# EasyEDA Pro project DreamFly.eprj, board PCB2
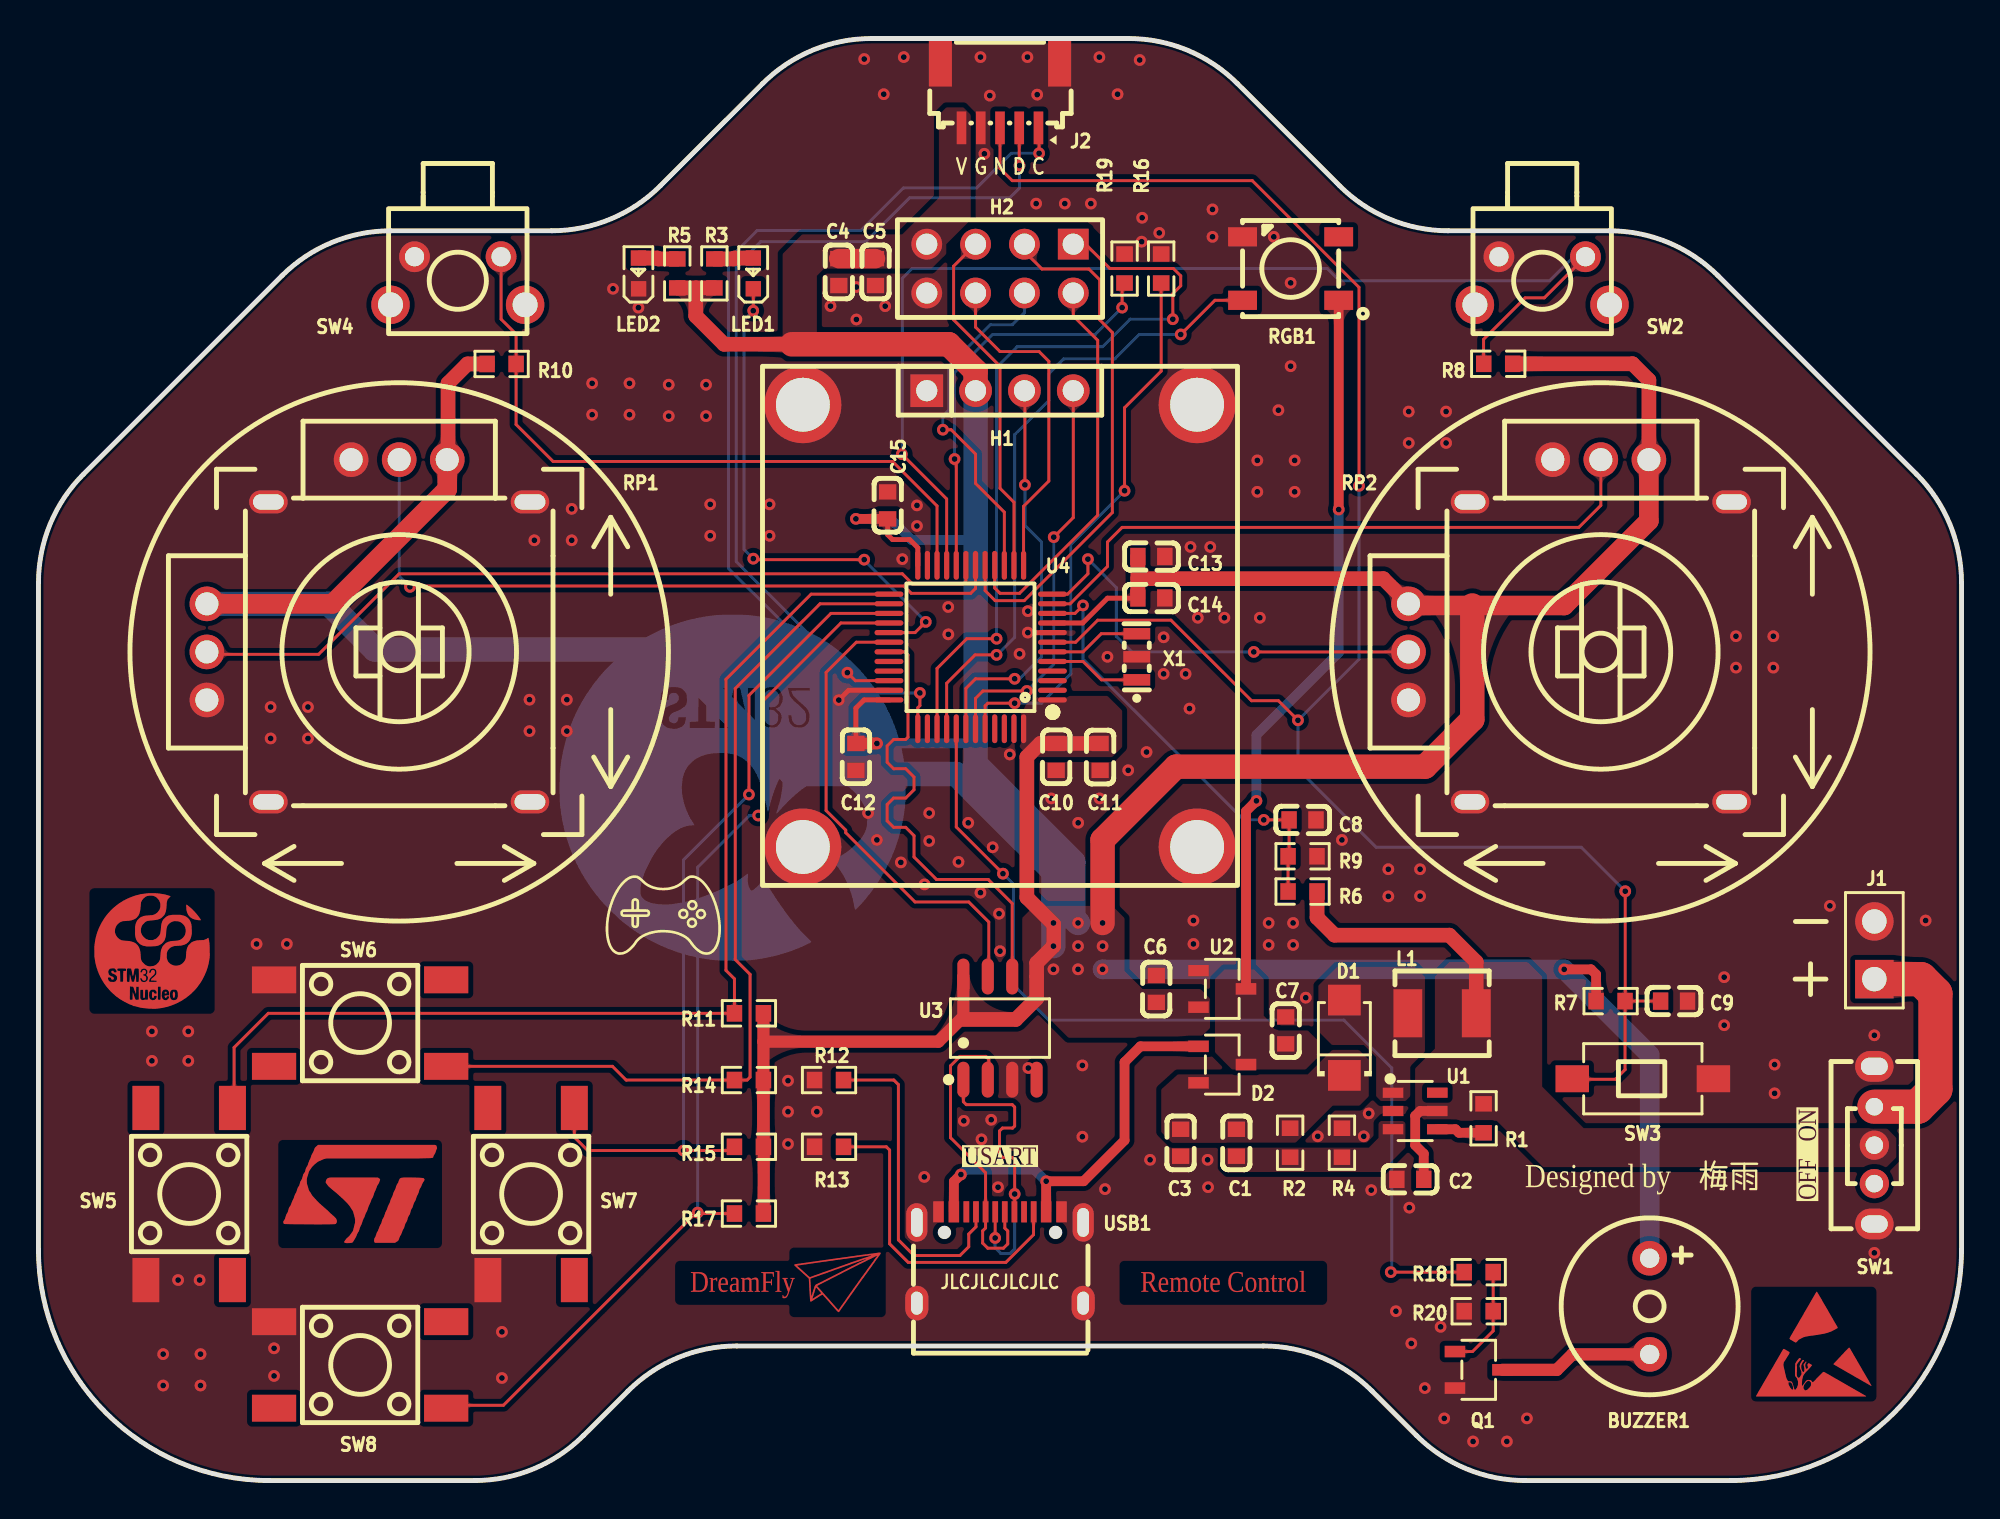
[diagram p6: board, top side]
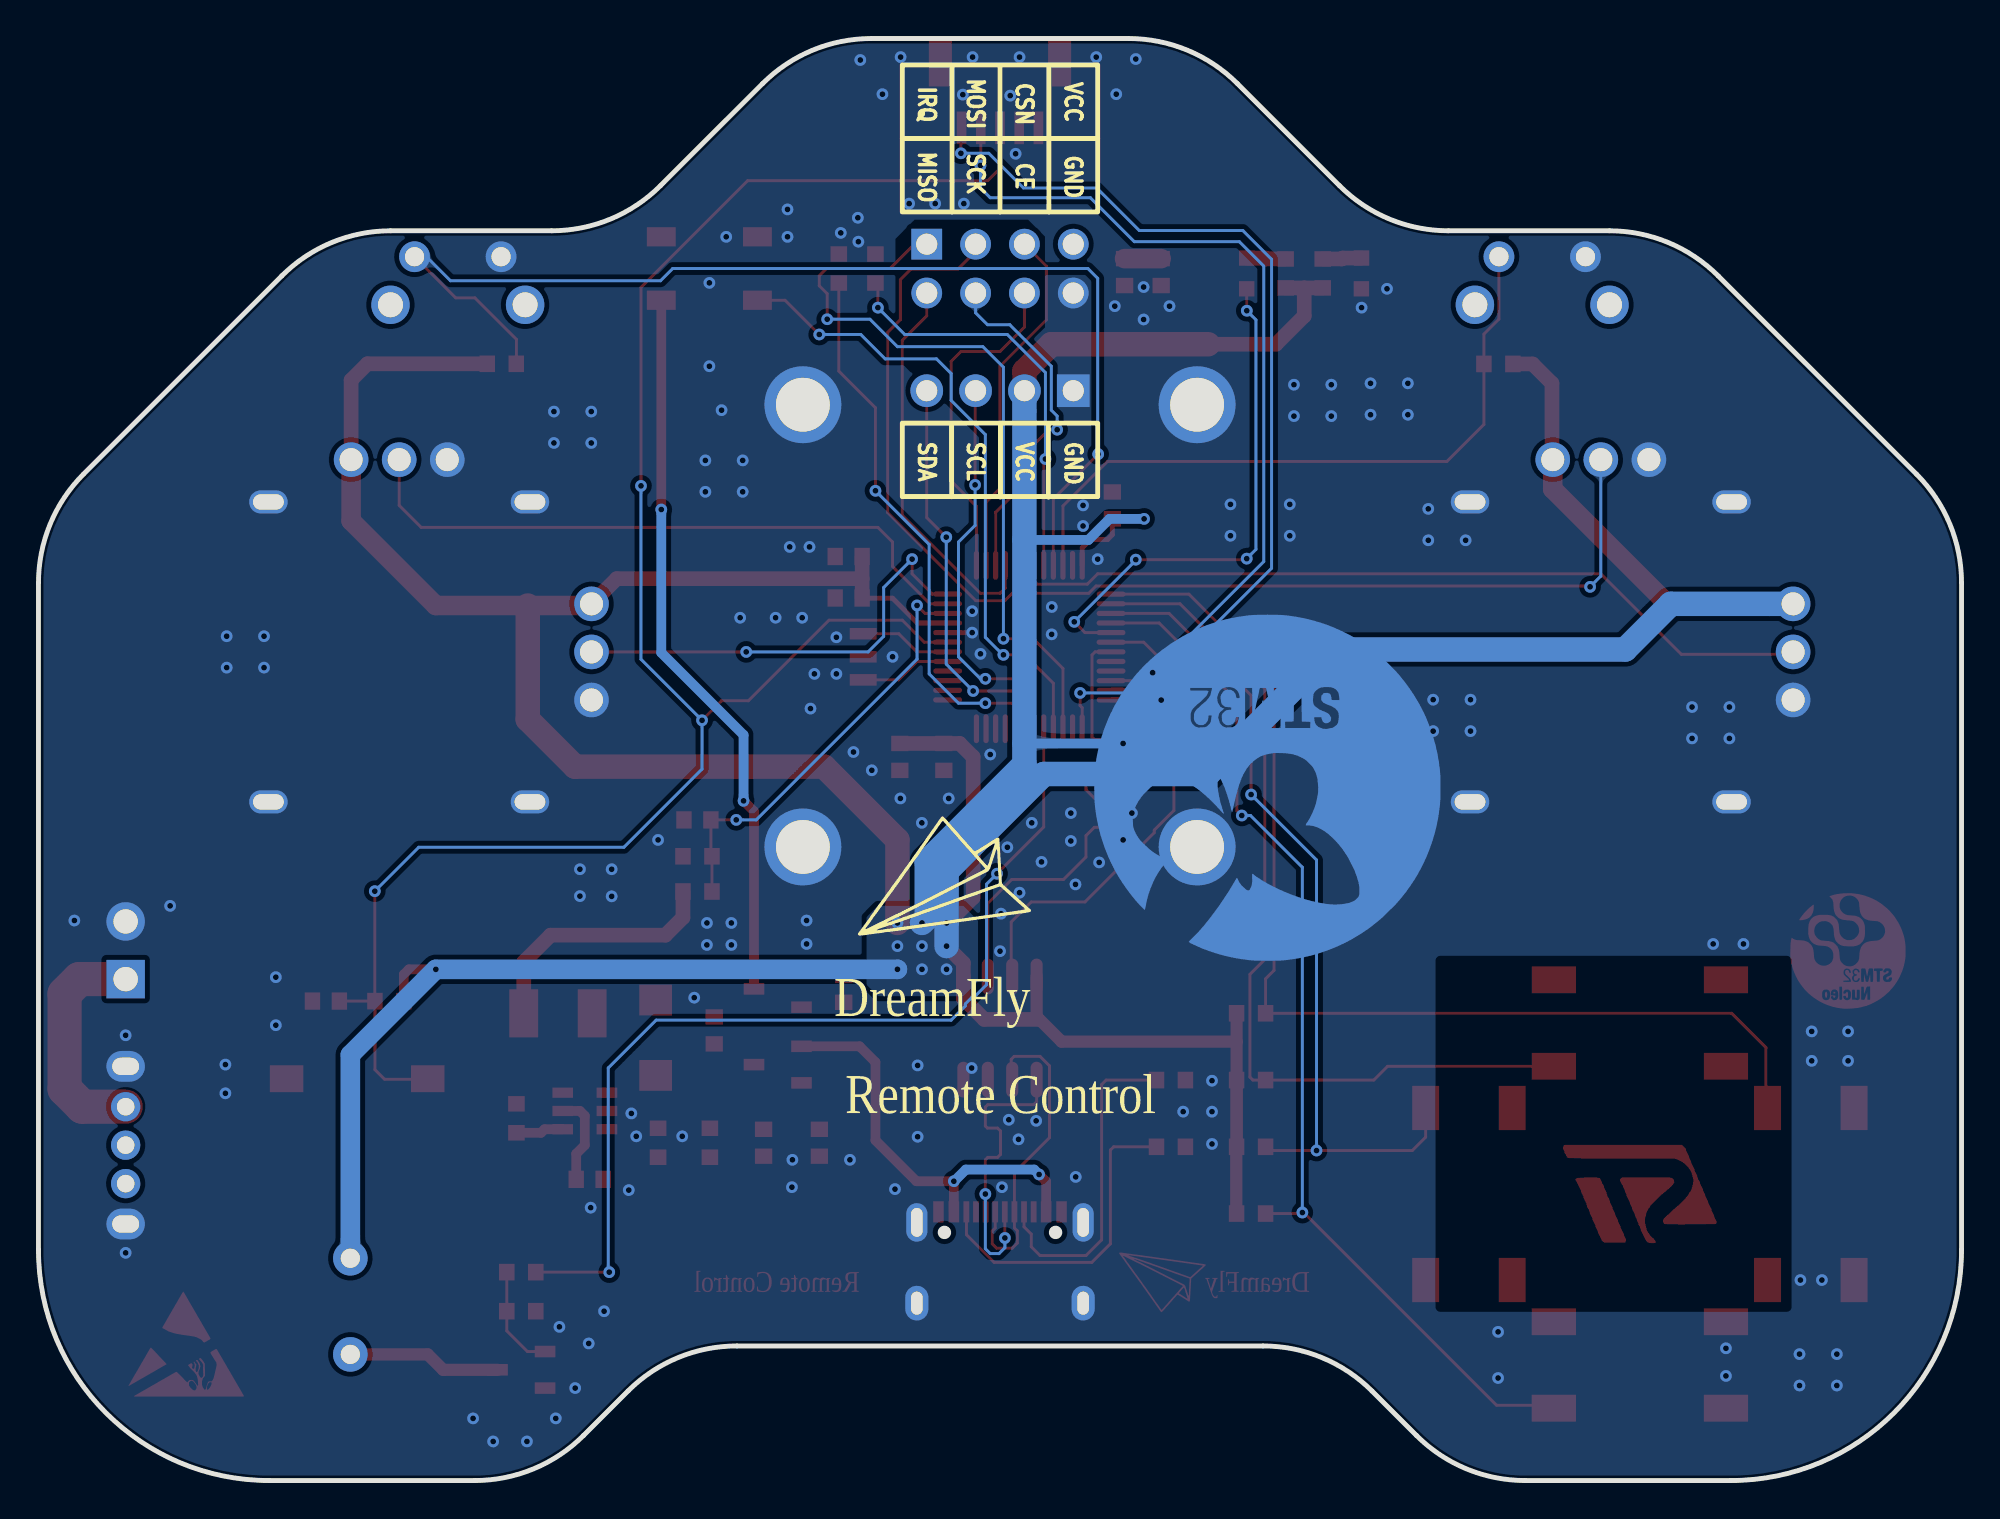
[diagram p7: board, bottom side, seen from below]

Outline 100 x 75 mm; copper layers: Top Layer, Bottom Layer. Coordinates in mm from the lower left corner of the outline.
Outline path: 0,46.69 0,12 arc(3.51,3.51) 12,0 22.69,0 arc(25.75,0.61) 28.34,2.34 30.66,4.66 arc(33.25,6.39) 36.31,7 63.69,7 arc(66.75,6.39) 69.34,4.66 71.66,2.34 arc(74.25,0.61) 77.31,0 88,0 arc(96.49,3.51) 100,12 100,46.69 arc(99.39,49.75) 97.66,52.34 87.34,62.66 arc(84.75,64.39) 81.69,65 73.31,65 arc(70.25,65.61) 67.66,67.34 62.34,72.66 arc(59.75,74.39) 56.69,75 43.31,75 arc(40.25,74.39) 37.66,72.66 32.34,67.34 arc(29.75,65.61) 26.69,65 18.31,65 arc(15.25,64.39) 12.66,62.66 2.34,52.34 arc(0.61,49.75) 0,46.69
Stack: Top Layer 0.035mm / Dielectric1 1.51mm FR4 er 4.5 / Bottom Layer 0.035mm

## Design rules (mm)
net USB_DM: DPDN
net USB_DP: DPDN
net U1_TX: USART
net U1_RX: USART
template: 自定义配置
spacing copperThickness1oz (default): track to track 0.102, other pairs 0 to 0.3
spacing copperThickness2oz: track to track 0.203, other pairs 0.152 to 0.3
track width copperThickness1oz (default): min 0.127, default 0.152, max 2.54
track width copperThickness2oz: min 0.203, default 0.254, max 2.54
differential pair differentialPair (default): width min 0.127, default 0.254, max 2.54; gap min 0.152, default 0.152
via viaSize (default): diameter min 0.5, default 0.61, max 10; hole min 0.3, default 0.305, max 6.299

## Placement (name value [footprint] x y rotation side)
BUZZER1  3kHz  [BUZ-TH_BD9.0-P5.00-D0.6-FD]  83.78 9.06 270 top
C1  15pF  [C0603]  62.29 17.57 90 top
C2  22uF  [C0603]  71.34 15.66 0 top
C3  22uF  [C0603]  59.39 17.57 90 top
C4  22uF  [C0603]  41.62 62.85 270 top
C5  100nF  [C0603]  43.52 62.85 270 top
C6  1uF  [C0603]  58.13 25.57 90 top
C7  1uF  [C0603]  64.86 23.41 90 top
C8  100nF  [C0603]  65.73 34.36 180 top
C9  100nF  [C0603]  85.05 24.94 0 top
C10  100nF  [C0603]  52.92 37.64 270 top
C11  100nF  [C0603]  55.21 37.64 90 top
C12  100nF  [C0603]  42.51 37.64 270 top
C13  1uF  [C0603]  57.87 48.06 180 top
C14  100nF  [C0603]  57.87 45.9 180 top
C15  100nF  [C0603]  44.16 50.72 270 top
D1  SS14F  [SMAF_L3.5-W2.6-LS4.7-RD]  67.91 23.03 90 top
D2  BAT54C  [SOT-23-3_L2.9-W1.6-P1.90-LS2.8-BR]  61.56 21.63 180 top
H1  Header 4  [HDR-TH_4P-P2.54-V-F]  50 56.68 0 top
H2  Header 8  [HDR-TH_8P-P2.54-V-F-R2-C4-S2.54]  50 63.03 180 top
J1  -  [BAT]  95.47 26.08 90 top
J2  SH1.0-5P  [CONN-SMD_5P-P1.00_BX-SH1.0-5PWT]  50 72.05 180 top
L1  4.7uH  [IND-SMD_L4.9-W4.4_MAPM0420F]  72.99 24.3 180 top
LED1  NCD0603B1  [LED0603-RD]  37.17 62.78 90 top
LED2  NCD0603R1  [LED0603-RD_RED]  31.2 62.78 90 top
NOREF  -  [Pad_e71]  39.75 55.95 0 top
NOREF#2  -  [Pad_e47]  39.75 32.95 0 top
NOREF#3  -  [Pad_e65]  60.25 32.95 0 top
NOREF#4  -  [Pad_e72]  60.25 55.95 0 top
Q1  S8050  [SOT-23-3_L2.9-W1.6-P1.90-LS2.8-BR]  74.89 5.76 180 top
R1  100kΩ  [R0603]  75.15 18.84 90 top
R2  73.2kΩ  [R0603]  65.09 17.57 90 top
R3  1kΩ  [R0603]  35.15 62.78 270 top
R4  10kΩ  [R0603]  67.78 17.57 270 top
R5  1kΩ  [R0603]  33.22 62.78 270 top
R6  100kΩ  [R0603]  65.73 30.64 180 top
R7  10kΩ  [R0603]  81.75 24.94 180 top
R8  10kΩ  [R0603]  75.91 58.08 0 top
R9  100kΩ  [R0603]  65.73 32.47 0 top
R10  10kΩ  [R0603]  24.08 58.07 180 top
R11  10kΩ  [R0603]  36.94 24.3 0 top
R12  5.1kΩ  [R0603]  41.11 20.83 180 top
R13  5.1kΩ  [R0603]  41.11 17.36 180 top
R14  10kΩ  [R0603]  36.94 20.83 0 top
R15  10kΩ  [R0603]  36.94 17.36 0 top
R16  10kΩ  [R0603]  58.38 63.04 270 top
R17  10kΩ  [R0603]  36.94 13.89 0 top
R18  1kΩ  [R0603]  74.89 10.84 180 top
R19  10kΩ  [R0603]  56.48 63.04 270 top
R20  10kΩ  [R0603]  74.89 8.81 0 top
RGB1  WS2812B  [LED-SMD_4P-L5.0-W5.0-BL_TC5050RGB]  65.11 63.04 180 top
RP1  LEFT  [RP-TH-LEFT]  18.76 43.1 0 top
RP2  RIGHT  [rp-th-right]  81.24 43.1 0 top
SW1  SS-12D07G4  [SW-TH_DEALON_SS-12D02-VGX]  95.47 17.44 270 top
SW2  TS-1093A-A5B3-D2  [KEY-TH_4P-L7.1-W8.9-P4.50-LS2.5]  78.19 62.4 180 top
SW3  TS-1101S-C-B-B-B-A  [SW-SMD_L6.0-W3.5-LS8.0]  83.43 20.9 180 top
SW4  TS-1093A-A5B3-D2  [KEY-TH_4P-L7.1-W8.9-P4.50-LS2.5]  21.81 62.4 180 top
SW5  TS-1002S-06026C  [KEY-SMD_4P-L6.0-W6.0-P4.50-LS9.5-BR]  7.84 14.9 90 top
SW6  TS-1002S-06026C  [KEY-SMD_4P-L6.0-W6.0-P4.50-LS9.5-BR]  16.73 23.79 0 top
SW7  TS-1002S-06026C  [KEY-SMD_4P-L6.0-W6.0-P4.50-LS9.5-BR]  25.62 14.9 90 top
SW8  TS-1002S-06026C  [KEY-SMD_4P-L6.0-W6.0-P4.50-LS9.5-BR]  16.73 6.01 0 top
U1  SX1308  [SOT-23-6_L2.9-W1.6-P0.95-LS2.8-BL]  71.59 19.22 270 top
U2  ME6206A33M3G  [SOT-23-3_L2.9-W1.6-P1.90-LS2.8-BR]  61.56 25.57 180 top
U3  CH340N  [SOP-8_L4.9-W3.9-P1.27-LS6.0-BL]  50 23.53 0 top
U4  STM32F103C8T6  [lqfp-48_l7.0-w7.0-p0.50-ls9.0-bl]  48.48 43.35 90 top
USB1  TYPE-C 16PIN  [USB-C-SMD_TYPE-C-6PIN-2MD-073]  50 11.6 0 top
X1  8MHz  [OSC-SMD_3P-L3.2-W1.3-P1.20-L]  57.11 42.84 90 top

## Footprints (pads in the part's own frame, mm; a bottom-side part is the same pattern mirrored in y, then rotated)
BAT
  rect 2x2 hole 1.27: 1(0,0)
  round 2 hole 1.27: 2(3,0)
BUZ-TH_BD9.0-P5.00-D0.6-FD
  round 1.8 hole 1: 1(-2.5,0) 2(2.5,0)
C0603
  rect 0.8x0.9 smd: 1(-0.7,0) 2(0.7,0)
CONN-SMD_5P-P1.00_BX-SH1.0-5PWT
  rect 0.5x1.7 smd: 1(-2,1.7) 2(-1,1.7) 3(0,1.7) 4(1,1.7) 5(2,1.7)
  rect 1.2x2.5 smd: 6(3.1,-1.7) 7(-3.1,-1.7)
HDR-TH_4P-P2.54-V-F
  rect 1.7x1.7 hole 1.1: 1(-3.81,0)
  round 1.7 hole 1.1: 2(-1.27,0) 3(1.27,0) 4(3.81,0)
HDR-TH_8P-P2.54-V-F-R2-C4-S2.54
  rect 1.6x1.6 hole 1.1: 1(-3.81,-1.27)
  round 1.6 hole 1.1: 2(-3.81,1.27) 3(-1.27,-1.27) 4(-1.27,1.27) 5(1.27,-1.27) 6(1.27,1.27) 7(3.81,-1.27) 8(3.81,1.27)
IND-SMD_L4.9-W4.4_MAPM0420F
  rect 1.5x2.5 smd: 1(-1.78,0) 2(1.78,0)
KEY-SMD_4P-L6.0-W6.0-P4.50-LS9.5-BR
  rect 2.3x1.4 smd: 1(4.475,-2.25) 2(-4.475,-2.25) 3(4.475,2.25) 4(-4.475,2.25)
KEY-TH_4P-L7.1-W8.9-P4.50-LS2.5
  round 1.6 hole 1: 1(-2.25,-1.25) 2(2.25,-1.25)
  round 2 hole 1.3: 3(-3.5,1.25) 4(3.5,1.25)
LED0603-RD
  rect 0.8x0.8 smd: 1(-0.799,0) 2(0.799,0)
LED0603-RD_RED
  rect 0.8x0.8 smd: 1(-0.799,-0.004) 2(0.799,0.004)
LED-SMD_4P-L5.0-W5.0-BL_TC5050RGB
  rect 1.5x1 smd: 1(-2.5,1.65) 2(-2.5,-1.65) 3(2.5,-1.65) 4(2.5,1.65)
lqfp-48_l7.0-w7.0-p0.50-ls9.0-bl
  oval 0.27x1.5 smd: 1(-2.75,-4.25) 2(-2.25,-4.25) 3(-1.75,-4.25) 4(-1.25,-4.25) 5(-0.75,-4.25) 6(-0.25,-4.25) 7(0.25,-4.25) 8(0.75,-4.25) 9(1.25,-4.25) 10(1.75,-4.25) 11(2.25,-4.25) 12(2.75,-4.25) 25(2.75,4.25) 26(2.25,4.25) 27(1.75,4.25) 28(1.25,4.25) 29(0.75,4.25) 30(0.25,4.25) 31(-0.25,4.25) 32(-0.75,4.25) 33(-1.25,4.25) 34(-1.75,4.25) 35(-2.25,4.25) 36(-2.75,4.25)
  oval 1.5x0.27 smd: 13(4.25,-2.75) 14(4.25,-2.25) 15(4.25,-1.75) 16(4.25,-1.25) 17(4.25,-0.75) 18(4.25,-0.25) 19(4.25,0.25) 20(4.25,0.75) 21(4.25,1.25) 22(4.25,1.75) 23(4.25,2.25) 24(4.25,2.75) 37(-4.25,2.75) 38(-4.25,2.25) 39(-4.25,1.75) 40(-4.25,1.25) 41(-4.25,0.75) 42(-4.25,0.25) 43(-4.25,-0.25) 44(-4.25,-0.75) 45(-4.25,-1.25) 46(-4.25,-1.75) 47(-4.25,-2.25) 48(-4.25,-2.75)
OSC-SMD_3P-L3.2-W1.3-P1.20-L
  rect 0.6x1.4 smd: 1(-1.199,0) 2(0,0) 3(1.199,0)
Pad_e47
  round 4 hole 2.8: 1(0,0)
Pad_e65
  round 4 hole 2.8: 1(0,0)
Pad_e71
  round 4 hole 2.8: 1(0,0)
Pad_e72
  round 4 hole 2.8: 1(0,0)
R0603
  rect 0.806x0.864 smd: 1(-0.753,0) 2(0.753,0)
RP-TH-LEFT
  round 1.8 hole 1.2: 1(2.5,10) 2(0,10) 3(-2.5,10) 4(-10,2.5) 5(-10,0) 6(-10,-2.5)
  oval 2x1.2 hole 1.6x0.8: 7(-6.8,-7.8) 8(6.8,-7.8) 9(6.8,7.8) 10(-6.8,7.8)
rp-th-right
  round 1.8 hole 1.2: 1(2.5,10) 2(0,10) 3(-2.5,10) 4(-10,2.5) 5(-10,0) 6(-10,-2.5)
  oval 2x1.2 hole 1.6x0.8: 7(-6.8,-7.8) 8(6.8,-7.8) 9(6.8,7.8) 10(-6.8,7.8)
SMAF_L3.5-W2.6-LS4.7-RD
  rect 1.6x1.7 smd: 1(-1.96,0) 2(1.96,0)
SOP-8_L4.9-W3.9-P1.27-LS6.0-BL
  oval 0.63x1.865 smd: 1(-1.905,-2.683) 2(-0.635,-2.683) 3(0.635,-2.683) 4(1.905,-2.683) 5(1.905,2.683) 6(0.635,2.683) 7(-0.635,2.683) 8(-1.905,2.683)
SOT-23-3_L2.9-W1.6-P1.90-LS2.8-BR
  rect 1.07x0.6 smd: 1(1.235,-0.95) 2(1.235,0.95) 3(-1.235,0)
SOT-23-6_L2.9-W1.6-P0.95-LS2.8-BL
  rect 0.532x1.072 smd: 1(-0.95,-1.149) 2(0,-1.149) 3(0.95,-1.149) 4(0.95,1.149) 5(0,1.149) 6(-0.95,1.149)
SW-SMD_L6.0-W3.5-LS8.0
  rect 1.74x1.4 smd: 1(-3.67,0) 2(3.67,0)
SW-TH_DEALON_SS-12D02-VGX
  round 1.524 hole 0.914: 1(-2,0) 2(0,0) 3(2,0)
  oval 1.6x2 hole 0.9x1.4: 4(4.1,0) 5(-4.1,0)
USB-C-SMD_TYPE-C-6PIN-2MD-073
  rect 0.55x1.1 smd: 1(-3.2,2.375) 2(-2.4,2.375) 11(2.4,2.375) 12(3.2,2.375)
  rect 0.3x1.1 smd: 3(-1.75,2.375) 4(-1.25,2.375) 5(-0.75,2.375) 6(-0.25,2.375) 7(0.25,2.375) 8(0.75,2.375) 9(1.25,2.375) 10(1.75,2.375)
  oval 1.1x2 hole 0.6x1.5: 13(-4.325,1.825) 14(4.325,1.825)
  oval 1.2x1.8 hole 0.6x1.2: 13(-4.325,-2.375) 14(4.325,-2.375)

## Nets
As in the schematic, except:
GND: C2.1 C3.1 C4.2 C5.2 C6.2 C7.2 C8.1 C9.2 C10.2 C11.1 C12.2 C13.1 C14.1 C15.1 H1.1 H2.8 J1.2 J2.4 J2.6 J2.7 LED2.1 NOREF.1 NOREF#2.1 NOREF#3.1 NOREF#4.1 Q1.2 R4.1 R9.2 R12.2 R13.2 R16.1 R19.1 R20.1 RGB1.3 RP1.3 RP1.6 RP1.7 RP1.8 RP1.9 RP1.10 RP2.3 RP2.6 RP2.7 RP2.8 RP2.9 RP2.10 SW1.4 SW1.5 SW2.2 SW3.1 SW4.2 SW5.4 SW6.4 SW7.4 SW8.4 U1.2 U2.1 U3.3 U4.8 U4.23 U4.35 U4.47 USB1.1 USB1.12 USB1.13 USB1.14 X1.2

Pads without a net: RGB1 2; SW1 3; SW2 3 4; SW4 3 4; SW5 2 3; SW6 2 3; SW7 2 3; SW8 2 3; U1 6; U3 4; U4 2 3 4 32 33 38 45 46; USB1 3 9

## Via types
v1: diameter 0.61, hole 0.305, Top Layer to Bottom Layer, 220 vias

## Routing (per net, layer and track width the routed paths; a pad name or vN(x,y) marks a point on that pad's centre or on a via; arc(x,y) is an arc through that point)
3V3: length 322.5
  Top Layer w0.254: C15.2 44.16,49.19 44.41,48.94 45.3,48.94 45.73,48.51 U4.24 ; C14.2 57.16,45.89 55.59,45.89 54.3,44.6 U4.9 ; U4.36 42.93,40.6 42.51,40.18 C12.1
  Top Layer w0.508: C15.2 v1(42.51,50.02) ; v1(79.34,26.59) 80.73,26.59 81,26.32 R7.2
  Top Layer w0.61: C12.1 v1(43.6,38.34)
  Top Layer w0.635: R11.2 37.7,22.83 ; 37.7,22.83 R14.2 ; 37.7,22.83 46.79,22.83 48.01,24.04 ; R17.2 37.72,13.9 37.72,17.34 R15.2 ; U3.8 48.09,24.21
  Top Layer w0.66: R14.2 R15.2
  Top Layer w0.762: C13.2 57.17,46.91 ; 57.17,46.91 C14.2 ; 57.17,46.91 69.93,46.91 RP2.4 ; 39.18,59.1 35.65,59.1 34.18,60.57 34.18,62.03 ; 48.07,23.98 50.82,23.98 51.91,25.07 U3.5 51.91,26.92 52.79,27.81 52.79,28.92 51.4,30.32 51.4,37.64 52.1,38.34 C10.1 C11.2 ; RP2.1 83.74,57.23 82.89,58.08 R8.2 ; 34.18,62.03 R5.2 ; 34.18,62.03 R3.2 ; RP1.1 21.3,53.14 21.3,57.07 22.31,58.07 R10.2 ; 71.37,45.47 71.33,45.51
  Top Layer w1.016: RP1.4 15.29,45.6 21.26,51.57 RP1.1 ; 71.33,45.51 79.34,45.51 83.74,49.91 RP2.1 ; C4.1 C5.1
  Top Layer w1.27: 39.18,59.1 47.33,59.1 48.73,57.7 48.73,56.53 ; 74.56,45.51 74.56,39.59 72.1,37.13 59.14,37.13 55.33,33.32 v1(55.33,29)
  Bottom Layer w0.508: 48.73,48.92 45.4,48.92 44.31,50.02 v1(42.51,50.02) ; v1(43.6,38.34) 48.73,38.34
  Bottom Layer w1.016: BUZZER1.1 83.78,22.14 v1(79.34,26.59) 55.34,26.59 v1(55.33,26.59)
  Bottom Layer w1.27: 48.73,56.53 48.73,37.25 53.81,32.17 53.81,29.25 v1(54.06,29) ; v1(52.78,27.8) v1(52.78,29) 52.78,31.68 47.71,36.75 39.18,36.75 32.7,43.22 17.49,43.22 15.11,45.6 RP1.4
  vias: v1(52.78,26.59) v1(54.06,27.8) v1(54.06,26.59) v1(55.33,27.8)
5V: length 37.8
  Top Layer w0.508: RGB1.1 v1(67.61,50.5) ; U2.3 62.79,34.81 v1(63.34,35.35)
  Bottom Layer w0.508: v1(67.61,50.5) 67.61,43.06 63.34,38.78 v1(63.34,35.35)
GND: length 4.1
  Top Layer w0.254: U4.8 v1(51.45,44.1) ; v1(41.62,40.59) 42.13,41.1 U4.35
  vias: v1(5.9,23.36) v1(5.9,21.83) v1(6.48,6.58) v1(6.48,4.94) v1(7.26,10.43) v1(7.79,23.36) v1(7.79,21.83) v1(8.38,10.43) v1(8.43,6.58) v1(8.43,4.94) v1(11.34,27.91) v1(12.07,40.23) v1(12.07,38.6) v1(12.25,6.88) v1(12.25,5.44) v1(12.92,27.91) v1(14.01,40.23) v1(14.01,38.6) v1(24.1,7.73) v1(24.1,5.33) v1(25.53,40.61) v1(25.53,38.98) v1(25.79,48.9) v1(27.48,40.61) v1(27.48,38.98) v1(27.73,50.54) v1(27.73,48.9) v1(28.79,57.07) v1(28.79,55.43) v1(29.88,61.98) v1(30.73,57.07) v1(30.73,55.43) v1(31.2,61) v1(32.77,56.99) v1(32.77,55.36) v1(34.72,56.99) v1(34.72,55.36) v1(34.93,50.77) v1(34.93,49.14) v1(38.02,50.77) v1(38.02,49.14) v1(38.98,20.8) v1(38.98,19.19) v1(38.98,17.5) v1(40.48,19.19) v1(41.19,61.08) v1(42.53,62.07) v1(42.53,60.39) v1(42.94,73.93) v1(43.14,34.71) v1(43.6,33.32) v1(43.96,72.1) v1(44.03,61.08) v1(44.84,32.15) v1(44.92,47.92) v1(45,74.03) v1(45.68,50.72) v1(45.68,49.65) v1(46.07,31.01) v1(46.06,15.79) v1(46.32,34.71) v1(46.32,33.26) v1(47.31,45.43) v1(47.31,44.01) v1(47.84,32.17) v1(48.12,18.71) v1(48.35,34.21) v1(48.98,74.03) v1(48.98,30.57) v1(49.04,17.75) v1(49.19,69) v1(49.47,72.03) v1(49.54,18.76) v1(49.62,32.94) v1(49.95,29.48) v1(49.9,15.26) v1(50,27.53) v1(50.51,37.76) v1(51.02,43) v1(51.43,74.03) v1(51.45,45.22) v1(51.47,21.46) v1(51.93,72.08) v1(51.88,66.41) v1(52.67,35.48) v1(53.37,66.41) v1(54.06,34.21) v1(54.28,21.59) v1(54.28,17.88) v1(54.72,66.41) v1(55.17,74.03) v1(55.18,35.48) v1(55.46,15.16) v1(55.59,42.84) v1(56.11,72.1) v1(56.67,36.94) v1(57.26,73.88) v1(57.39,65.68) v1(57.37,64.43) v1(57.62,37.89) v1(57.8,16.68) v1(58.28,64.89) v1(58.51,43.86) v1(58.51,41.95) v1(59.65,41.95) v1(59.91,48.56) v1(59.85,40.15) v1(60.06,29.13) v1(60.06,27.91) v1(60.29,44.87) v1(60.79,16.68) v1(60.82,15.26) v1(60.93,48.56) v1(61.05,66.11) v1(61.05,64.69) v1(61.67,44.87) v1(63.38,53.06) v1(63.38,51.42) v1(63.51,44.87) v1(63.97,29) v1(63.97,27.86) v1(64.24,64.69) v1(64.48,55.67) v1(65.11,62.29) v1(65.11,57.96) v1(65.24,29) v1(65.24,27.86) v1(65.32,53.06) v1(65.32,51.42) v1(65.9,25.11) v1(66.52,17.9) v1(67.78,33.32) v1(68.92,17.9) v1(69.17,19.09) v1(69.3,15.11) v1(70.19,31.79) v1(70.19,30.38) v1(70.59,8.81) v1(71.25,55.6) v1(71.25,53.96) v1(71.28,14.19) v1(71.39,7.13) v1(71.84,31.79) v1(71.84,30.4) v1(72.09,4.81) v1(72.91,7.99) v1(73.1,3.23) v1(73.2,55.6) v1(73.2,53.96) v1(74.6,2.03) v1(76.36,2.03) v1(77.4,3.23) v1(87.66,26.18) v1(87.66,23.68) v1(88.27,43.91) v1(88.27,42.28) v1(90.21,43.91) v1(90.21,42.28) v1(90.28,21.63) v1(90.28,20.14) v1(93.15,29.89) v1(95.47,23.16) v1(95.47,11.84) v1(98.13,29.13)
VBAT: length 18
  Top Layer w0.508: U1.5 71.84,19.22 71.59,18.97 71.59,17.44 72.04,17 C2.2
  Top Layer w0.762: R6.1 66.49,29.28 67.4,28.36 73.37,28.36 74.76,26.97 74.76,24.3 L1.1
VBUS: length 21.5
  Top Layer w0.508: USB1.2 47.6,15.55 v1(47.97,15.92) ; D2.1 57.3,22.58 56.48,21.76 56.48,17.7 54.35,15.57 v1(52.4,15.57) USB1.11
  Bottom Layer w0.508: 52.29,15.66 51.78,16.17 48.22,16.17 v1(47.97,15.92)
ADC_BAT: length 22.5
  Top Layer w0.152: U4.10 53.9,45.1 v1(54.31,45.51) ; v1(63.72,34.36) C8.2 65.03,32.52 64.98,32.47 64.98,30.64
  Bottom Layer w0.152: v1(54.31,45.51) 54.31,42.72 62.67,34.36 v1(63.72,34.36)
ADC_PITCH: length 23.2
  Top Layer w0.152: U4.12 53.51,46.1 54.57,47.16 v1(54.57,47.92) ; v1(63.2,43.1) RP2.5
  Bottom Layer w0.152: v1(63.2,43.1) 56.86,43.1 56.05,43.91 56.05,46.45 v1(54.57,47.92)
ADC_ROLL: length 33.8
  Top Layer w0.152: U4.11 53.65,45.6 55.59,47.54 55.59,48.81 56.35,49.57 80.1,49.57 81.24,50.72 RP2.2
ADC_THURUST: length 42.4
  Top Layer w0.152: RP1.5 8.89,42.97 14.57,42.97 18.76,47.16 44.92,47.16 45.46,46.62 48.07,46.62 48.23,46.77 U4.19
ADC_YAW: length 37.7
  Top Layer w0.152: v1(19.32,46.48) 19.36,46.53 45.01,46.53 45.39,46.14 48.48,46.14 48.73,46.39 U4.18
  Bottom Layer w0.152: RP1.2 18.76,47.04 v1(19.32,46.48)
BUZZER: length 50.5
  Top Layer w0.152: U4.41 47.73,33.99 v1(50.15,31.56) ; v1(70.32,10.84) R18.2
  Bottom Layer w0.152: v1(70.32,10.84) 70.37,10.89 70.37,21.46 67.88,23.95 52.54,23.95 51.8,24.68 51.8,24.79 51.49,25.1 51.38,25.1 50.7,25.79 50.7,31.02 v1(50.15,31.56)
KEY1: length 60.8
  Top Layer w0.152: SW2.1 78.31,61.51 77.31,61.51 75.15,59.35 75.15,58.09 R8.1 ; U4.21 47.23,51.05 v1(44.89,53.38)
  Bottom Layer w0.152: v1(44.89,53.38) 44.92,53.41 44.92,62.53 45.43,63.04 67.02,63.04 67.65,62.4 78.57,62.4 79.82,63.65 SW2.1
KEY2: length 35.8
  Top Layer w0.152: U4.22 46.73,50.69 44.41,53 26.76,53 24.84,54.93 R10.1 24.84,59.62 24.06,60.4 SW4.1
KEY3: length 58.1
  Top Layer w0.152: 36.44,24.3 R11.1 ; R11.1 36.19,26.09 35.75,26.53 35.75,41.67 40.18,46.1 U4.25 ; R11.1 11.95,24.3 10.17,22.52 10.17,19.46 SW5.1
KEY4: length 46.5
  Top Layer w0.152: U4.26 40.64,45.6 36.23,41.19 36.23,27.09 37,26.32 37,20.98 36.85,20.83 R14.1 30.56,20.83 29.85,21.54 SW6.1
KEY5: length 44.6
  Top Layer w0.152: U4.27 41.21,45.1 36.94,40.84 v1(36.94,35.68) ; 36.44,17.36 36.25,17.16 v1(33.54,17.16) 28.56,17.16 27.87,17.86 SW7.1
  Bottom Layer w0.152: v1(36.94,35.68) 33.54,32.28 v1(33.54,17.16)
KEY6: length 56.2
  Top Layer w0.152: SW8.1 21.35,3.92 24.18,3.92 34.3,14.04 34.3,13.96 v1(34.28,13.94) 34.33,13.89 36.44,13.89 ; U4.28 41.72,44.6 37.68,40.56 37.68,34.84 v1(37.43,34.59)
  Bottom Layer w0.152: v1(37.43,34.59) 36.97,34.59 34.28,31.9 v1(34.28,13.94)
NRF_CE: length 17.5
  Top Layer w0.152: H2.6 48.73,59.99 50,58.72 52.03,58.72 52.54,58.21 52.54,51.99 51.23,50.67 U4.13
NRF_CSN: length 18.5
  Top Layer w0.152: H2.5 47.59,63.16 47.59,60.37 50,57.96 50,51.61 50.73,50.88 U4.14
NRF_IRQ: length 39.9
  Top Layer w0.152: v1(58.99,60.4) 58.99,61.73 59.4,62.14 59.4,62.65 59.02,63.04 55.72,63.04 54.45,64.3 H2.1 ; U4.39 46.73,42.24 48.27,43.78 v1(49.82,43.78)
  Bottom Layer w0.152: v1(58.99,60.4) 56.76,60.4 55.33,58.97 50.89,58.97 49.82,57.9 v1(49.82,43.78)
NRF_MISO: length 20.4
  Top Layer w0.152: U4.16 49.73,46.42 50,46.14 51.02,46.14 55.08,50.21 55.08,59.3 53.81,60.57 H2.2
NRF_MOSI: length 27.3
  Top Layer w0.152: U4.17 49.23,46.28 49.75,45.76 51.26,45.76 55.84,50.35 55.84,59.71 55.18,60.37 55.18,62.45 54.62,63.01 52.18,63.01 51.27,63.92 H2.3
NRF_SCK: length 18.2
  Top Layer w0.152: U4.15 50.23,50.36 48.73,51.86 48.73,53.38 47.46,54.65 v1(47.03,54.65)
  Bottom Layer w0.152: v1(47.03,54.65) 47.03,55.36 47.33,55.67 47.33,57.96 49.49,60.11 50.65,60.11 51.27,60.74 H2.4
NRST: length 98.9
  Top Layer w0.152: v1(68.67,51.73) 68.67,62.06 63.12,67.61 50.63,67.61 50,68.24 J2.3 ; SW3.2 79.78,20.87 82,20.87 82.5,21.37 R7.1 ; v1(65.49,39.54) 64.48,40.56 63.08,40.56 58.89,44.75 55.08,44.75 53.93,43.6 U4.7 ; v1(82.51,30.65) 82.51,24.94 R7.1 ; R7.1 C9.1
  Bottom Layer w0.152: v1(68.67,51.73) 68.67,42.72 v1(65.49,39.54) 65.49,37 69.56,32.94 80.23,32.94 v1(82.51,30.65)
OLED_SCL: length 20.8
  Top Layer w0.152: U4.42 48.23,41.2 48.73,41.7 v1(50.76,41.7) ; v1(51.3,51.78) 51.3,56.51 51.27,56.53
  Bottom Layer w0.152: v1(51.3,51.78) 51.3,49.68 52.16,48.81 52.16,42.84 51.02,41.7 v1(50.76,41.7)
OLED_SDA: length 21
  Top Layer w0.152: v1(52.79,49.07) 53.81,50.08 53.81,56.53 ; v1(51.4,41.06) 49.11,41.06 48.73,40.68 U4.43
  Bottom Layer w0.152: 52.79,49.19 52.79,42.46 v1(51.4,41.06)
OSC_IN: length 4.8
  Top Layer w0.152: U4.5 54.32,42.6 55.28,41.64 X1.1
OSC_OUT: length 4.8
  Top Layer w0.152: U4.6 54.32,43.1 55.26,44.04 X1.3
RGB_LED: length 33
  Top Layer w0.152: v1(59.4,59.61) 61.18,61.39 RGB1.4 ; U4.40 47.23,41.47 48.7,42.94 v1(49.82,42.94)
  Bottom Layer w0.152: v1(59.4,59.61) 57.24,59.61 55.97,58.34 53.3,58.34 52.54,57.57 52.54,56.18 50.76,54.4 50.76,43.86 49.85,42.94 v1(49.82,42.94)
SWCLK: length 50.4
  Top Layer w0.152: U4.37 45.73,40.19 45.83,40.3 v1(45.83,40.96) ; v1(52.03,69.03) 52.03,70.32 J2.1
  Bottom Layer w0.152: v1(45.83,40.96) 42.36,40.96 35.88,47.45 35.88,63.52 37.37,65.01 42.76,65.01 44.97,67.23 48.78,67.23 50.58,69.03 v1(52.03,69.03)
SWDIO: length 45.4
  Top Layer w0.152: J2.2 51,68.41 v1(51.02,68.4) ; U4.34 42.48,41.6 v1(42.06,42.02)
  Bottom Layer w0.152: v1(51.02,68.4) 51.02,67.23 50.51,66.72 45.3,66.72 43.01,64.43 37.55,64.43 36.28,63.16 36.28,47.8 v1(42.06,42.02)
U1_RX: length 25.1
  Top Layer w0.152: U4.31 45.05,43.1 45.22,42.94 45.22,38.66 45.1,38.54 44.47,38.54 44.13,38.21 44.13,37.36 44.47,37.02 45.1,37.02 45.53,36.59 45.53,35.93 45.1,35.5 44.47,35.5 44.13,35.16 44.13,34.31 44.47,33.97 45.1,33.97 45.53,33.54 45.53,32.43 46.7,31.26 49.39,31.26 50.63,30.02 U3.6
U1_TX: length 24.7
  Top Layer w0.152: U4.30 42.53,43.6 40.96,42.03 40.96,34.85 41.98,33.83 41.98,33.69 45.58,30.09 48.37,30.09 49.42,29.05 49.42,26.47 49.37,26.42
USB_DM: length 16.6
  Top Layer w0.152: U3.2 49.42,20.9 49.42,21.91 49.26,22.06 47.92,22.06 47.43,21.57 47.43,17.83 49.25,16.01 USB1.5 49.25,13.14 49.1,12.98 49.1,12.35 49.37,12.08 50.18,12.08 50.4,12.31 50.4,12.98 50.25,13.13 USB1.7
USB_DP: length 16.6
  Top Layer w0.152: v1(49.75,12.62) 49.75,12.62 USB1.6 ; U3.1 48.09,19.7 48.25,19.55 50.63,19.55 50.76,19.42 50.76,18.44 50.65,18.33 50.13,18.33 49.97,18.18 49.97,16.96 50.13,16.81 50.63,16.81 50.76,16.68 v1(50.76,14.9) 50.76,13.99 USB1.8
  Bottom Layer w0.152: v1(49.75,12.62) 49.75,12.11 50.05,11.8 50.51,11.8 50.76,12.06 v1(50.76,14.9)
USER_LED: length 26.9
  Top Layer w0.152: v1(37.17,47.95) 37.22,47.9 v1(42.94,47.9) ; LED1.1 37.17,60.85 v1(37.17,60.84) ; U4.29 45.58,44.1 v1(46.14,44.66)
  Bottom Layer w0.152: 37.15,60.83 36.69,60.37 36.69,48.43 v1(37.17,47.95) ; v1(46.14,44.66) 42.94,47.86 v1(42.94,47.9)
$1N4079: length 2
  Top Layer w0.762: LED2.2 32.18,63.58 32.23,63.54 R5.1
$1N4080: length 2
  Top Layer w0.762: R3.1 36.15,63.54 36.19,63.58 LED1.2
$1N4159: length 28.6
  Top Layer w0.152: U4.44 49.23,40.29 49.37,40.43 v1(50.76,40.43) ; v1(56.48,51.48) 56.48,55.8 58.38,57.7 R16.2
  Bottom Layer w0.152: v1(56.48,51.48) 53.68,48.68 53.68,41.95 52.16,40.43 v1(50.76,40.43)
$1N4198: length 2.5
  Top Layer w0.508: U1.4 73.68,18.27 73.87,18.09 R1.1
$1N4533: length 8
  Top Layer w0.635: Q1.3 78.96,5.76 79.76,6.56 BUZZER1.2
$1N4621: length 5.5
  Top Layer w0.152: R18.1 R20.2 75.65,7.78 74.57,6.71 Q1.1
$1N6920: length 21.5
  Top Layer w0.152: v1(56.35,61) 56.35,62.16 R19.2 ; v1(47.64,53.13) 47.73,53.04 U4.20
  Bottom Layer w0.152: v1(56.35,61) 54.95,59.61 49.62,59.61 47.64,57.63 v1(47.64,53.13)
$1N17164: length 12
  Top Layer w1.778: SW1.1 97.72,19.44 98.64,20.36 98.64,25.32 97.88,26.08 J1.1
$1N35382: length 17
  Top Layer w0.152: R13.1 44.09,17.36 44.26,17.19 44.26,12.31 45.22,11.35 50.31,11.35 51.74,12.79 51.74,13.97 USB1.10
$1N35388: length 17.2
  Top Layer w0.152: R12.1 44.48,20.83 44.72,20.59 44.72,12.52 45.53,11.7 47.92,11.7 48.37,12.16 48.37,12.82 48.75,13.2 USB1.4

## Copper pours and planes (outline as drawn; the poured copper is in the pictures)
3V3 on Top Layer: 48.09,71.42 48.48,71.04 48.48,65.58 47.21,64.31 47.21,63.8 46.44,63.04 45.01,63.04 45.01,63.03 40.85,63.03 40.47,62.65 40.47,58.72 40.22,58.46 38.95,58.46 38.7,58.72 38.7,63.8 39.71,64.81 44.92,64.81 46.82,66.72 46.82,71.04 47.21,71.42
3V3 on Top Layer: 60.42,25.56 61.05,24.94 61.05,23.67 60.41,23.03 53.56,23.03 51.16,25.43 51.16,29.27 51.78,29.89 55.84,29.89 56.48,29.25 56.48,26.5 57.42,25.56
3V3 on Top Layer: 51.81,40.81 51.02,40.02 51.02,38.14 51.54,37.63 55.83,37.63 56.35,38.14 56.35,40.05 55.59,40.81
3V3 on Bottom Layer: 51.91,29.89 51.14,29.13 51.14,25.95 51.91,25.19 56.34,25.19 56.94,25.78 56.94,29.3 56.35,29.89
5V on Top Layer: 61.67,26.59 61.18,26.09 61.18,22.27 62.19,21.25 65.87,21.25 66.56,21.94 66.56,22.86 66,23.41 64.48,23.41 63.72,24.17 63.72,26.08 63.21,26.59
GND on Top Layer: 110,77.5 110,-2.5 -10,-2.5 -10,77.5
GND on Bottom Layer: 110.15,77.45 110.15,-2.55 -9.85,-2.55 -9.85,77.45
VBAT on Top Layer: 96.1,18.33 96.61,17.82 96.61,16.81 96.1,16.3 78.24,16.3 75.82,18.71 72.1,18.71 71.59,19.22 71.59,21.44 72.61,22.46 72.61,26.21 73.37,26.97 77.43,26.97 78.19,26.21 78.19,20.49 80.35,18.33
$1N4196 on Top Layer: 69.94,18.84 69.69,18.59 69.69,17.82 69.18,17.32 61.79,17.32 61.58,17.1 61.58,16.3 61.83,16.05 69.81,16.05 71.08,17.32 71.08,18.59 70.83,18.84
$1N4197 on Top Layer: 67.53,26.71 66.56,25.74 66.56,23.36 67.27,22.65 68.92,22.65 69.56,22.01 69.56,19.98 69.81,19.73 71.08,19.73 71.34,19.98 71.34,21.51 72.1,22.27 72.1,26.21 71.59,26.71
$1N4201 on Top Layer: 59.25,21.13 58.38,20.34 58.38,18.13 58.95,17.56 65.36,17.56 67.29,19.5 68.69,19.5 69.18,19.98 69.18,21.89 68.67,22.4 67.27,22.4 66,21.13

Small or netless copper shapes (teardrops, artwork), in the pictures only: 174 on Top Layer, 48 on Bottom Layer

## Text on the board
Bottom Silkscreen Layer: VCC | SCL | SDA | GND | CSN | CE | MOSI | SCK | IRQ | MISO | Remote Control | DreamFly
Top Layer: DreamFly | Remote Control
Top Solder Mask Layer: DreamFly | Remote Control
Top Silkscreen Layer: JLCJLCJLCJLC | V | G | N | D | C | OFF   ON | USART | Designed by | 梅雨
